# EAGLE design busstop (EAGLE 6.6.0)
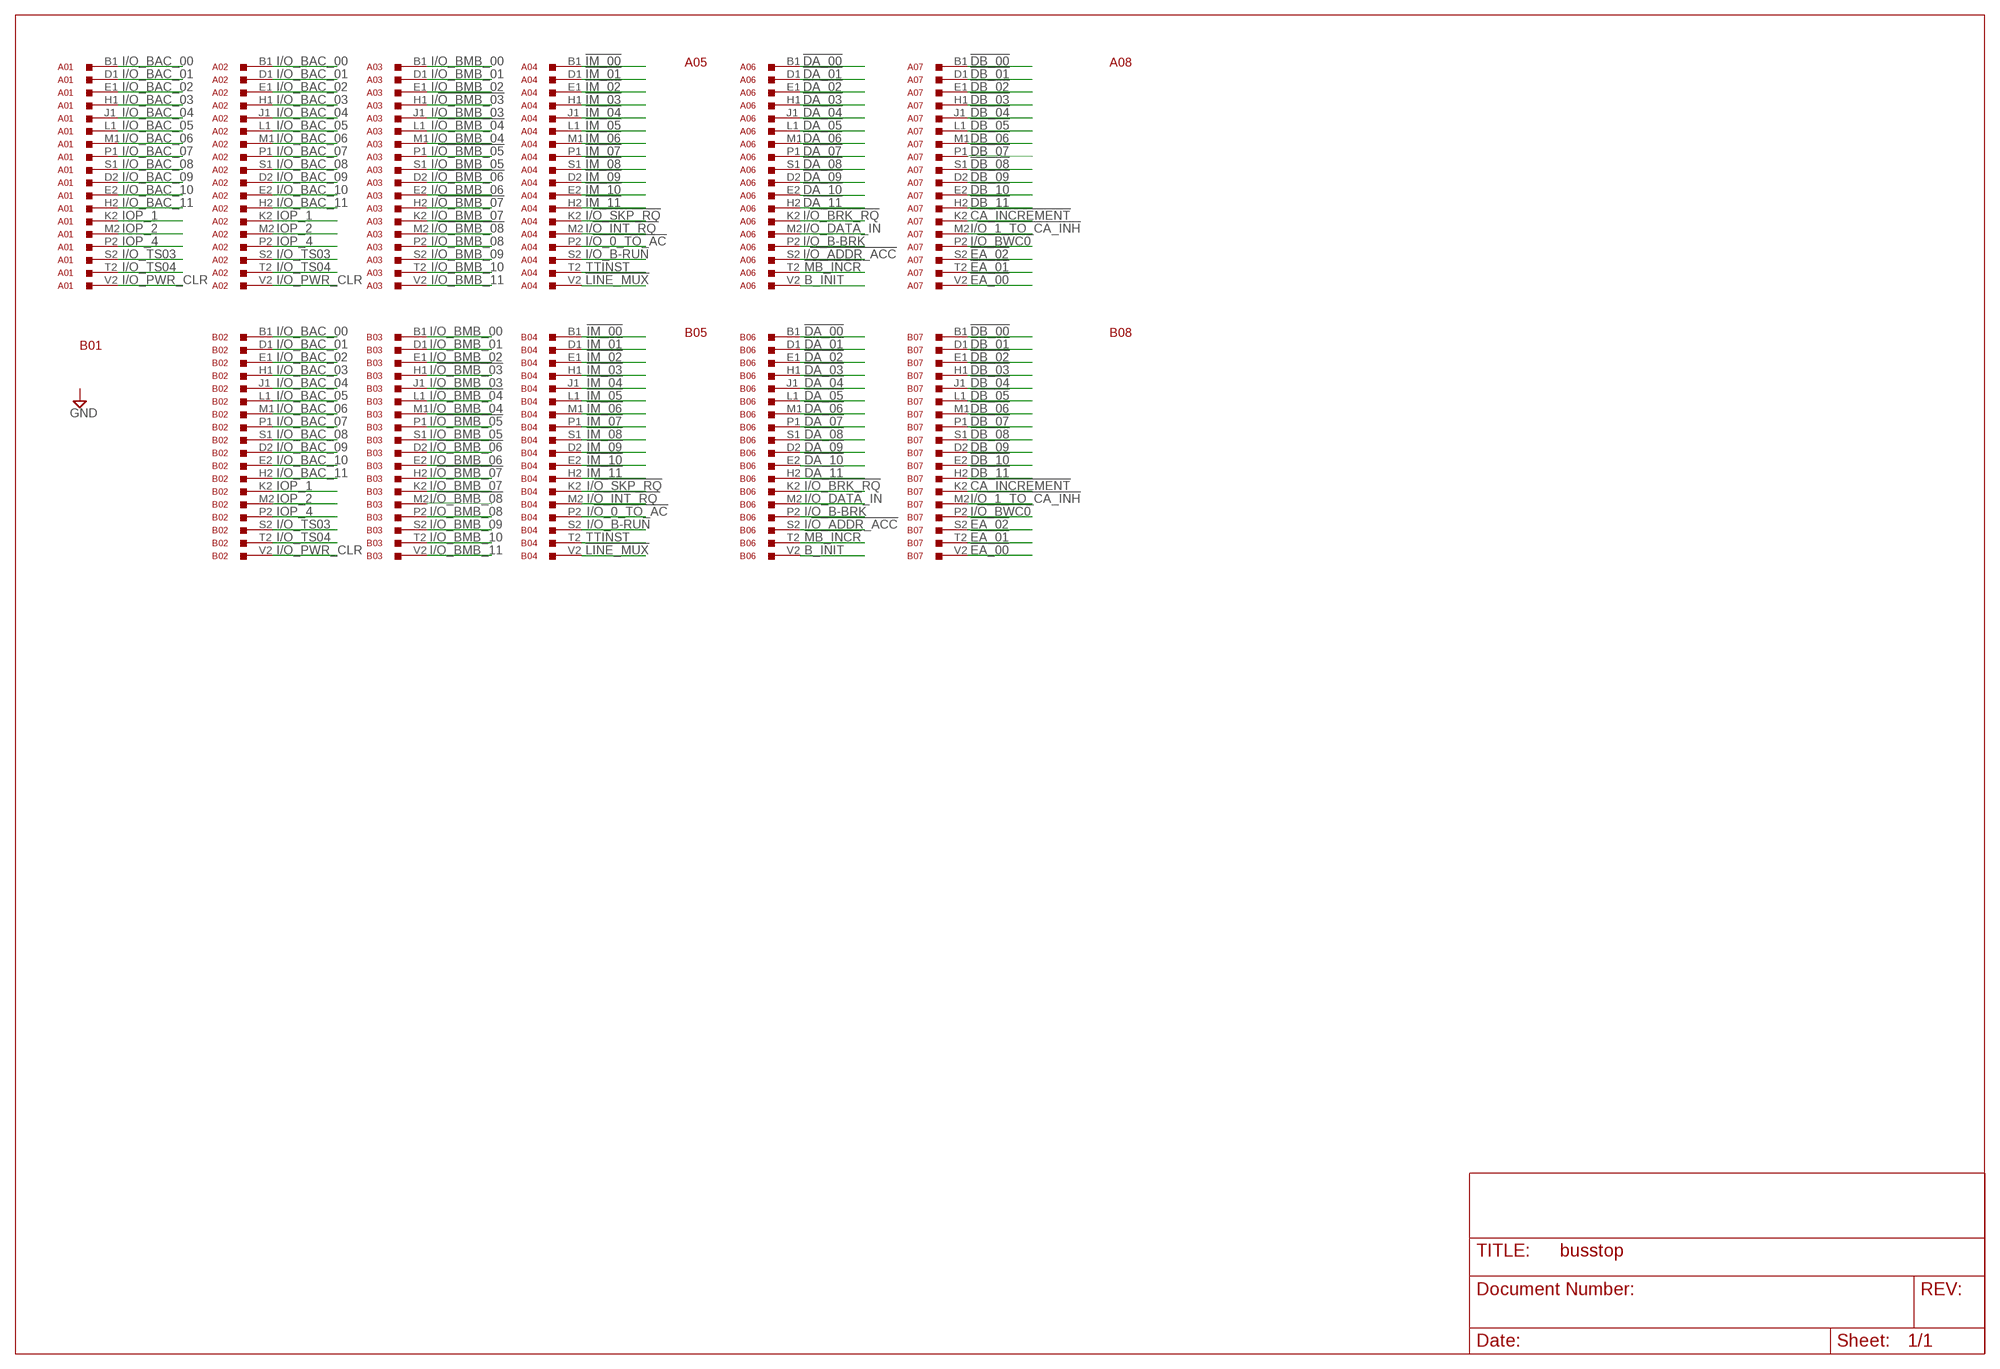
[diagram p0: schematic, sheet 1]

## Parts
A01  G717  M903  [H807]
A02  M903  [H807]
A03  M903  [H807]
A04  M903  [H807]
A05  H807  [H807]
A06  M903  [H807]
A07  M903  [H807]
A08  H807  [H807]
B01  H807  [H807]
B02  M903  [H807]
B03  M903  [H807]
B04  M903  [H807]
B05  H807  [H807]
B06  M903  [H807]
B07  M903  [H807]
B08  H807  [H807]

## Nets
!CA_INCREMENT: A07.K2 B07.K2
!DA_00: A06.B1 B06.B1
!DA_01: A06.D1 B06.D1
!DA_02: A06.E1 B06.E1
!DA_03: A06.H1 B06.H1
!DA_04: A06.J1 B06.J1
!DA_05: A06.L1 B06.L1
!DA_06: A06.M1 B06.M1
!DA_07: A06.P1 B06.P1
!DA_08: A06.S1 B06.S1
!DA_09: A06.D2 B06.D2
!DA_10: A06.E2 B06.E2
!DA_11: A06.H2 B06.H2
!DB_00: A07.B1 B07.B1
!DB_01: A07.D1 B07.D1
!DB_02: A07.E1 B07.E1
!DB_03: A07.H1 B07.H1
!DB_04: A07.J1 B07.J1
!DB_05: A07.L1 B07.L1
!DB_06: A07.M1 B07.M1
!DB_07: A07.P1 B07.P1
!DB_08: A07.S1 B07.S1
!DB_09: A07.D2 B07.D2
!DB_10: A07.E2 B07.E2
!DB_11: A07.H2 B07.H2
!EA_00: A07.V2 B07.V2
!EA_01: A07.T2 B07.T2
!EA_02: A07.S2 B07.S2
!IM_00: A04.B1 B04.B1
!IM_01: A04.D1 B04.D1
!IM_02: A04.E1 B04.E1
!IM_03: A04.H1 B04.H1
!IM_04: A04.J1 B04.J1
!IM_05: A04.L1 B04.L1
!IM_06: A04.M1 B04.M1
!IM_07: A04.P1 B04.P1
!IM_08: A04.S1 B04.S1
!IM_09: A04.D2 B04.D2
!IM_10: A04.E2 B04.E2
!IM_11: A04.H2 B04.H2
!LINE_MUX: A04.V2 B04.V2
!MB_INCR: A06.T2 B06.T2
B_INIT: A06.V2 B06.V2
I/!O_0_TO_AC: A04.P2 B04.P2
I/!O_1_TO_CA_INH: A07.M2 B07.M2
I/!O_ADDR_ACC: A06.S2 B06.S2
I/!O_BMB_03: A03.H1 B03.H1
I/!O_BMB_04: A03.L1 B03.L1
I/!O_BMB_05: A03.P1 B03.P1
I/!O_BMB_06: A03.D2 B03.D2
I/!O_BMB_07: A03.H2 B03.H2
I/!O_BMB_08: A03.M2 B03.M2
I/!O_BRK_RQ: A06.K2 B06.K2
I/!O_BWC0: A07.P2 B07.P2
I/!O_INT_RQ: A04.M2 B04.M2
I/!O_SKP_RQ: A04.K2 B04.K2
I/O_B-BRK: A06.P2 B06.P2
I/O_B-RUN: A04.S2 B04.S2
I/O_BAC_00: A01.B1 A02.B1 B02.B1
I/O_BAC_01: A01.D1 A02.D1 B02.D1
I/O_BAC_02: A01.E1 A02.E1 B02.E1
I/O_BAC_03: A01.H1 A02.H1 B02.H1
I/O_BAC_04: A01.J1 A02.J1 B02.J1
I/O_BAC_05: A01.L1 A02.L1 B02.L1
I/O_BAC_06: A01.M1 A02.M1 B02.M1
I/O_BAC_07: A01.P1 A02.P1 B02.P1
I/O_BAC_08: A01.S1 A02.S1 B02.S1
I/O_BAC_09: A01.D2 A02.D2 B02.D2
I/O_BAC_10: A01.E2 A02.E2 B02.E2
I/O_BAC_11: A01.H2 A02.H2 B02.H2
I/O_BMB_00: A03.B1 B03.B1
I/O_BMB_01: A03.D1 B03.D1
I/O_BMB_02: A03.E1 B03.E1
I/O_BMB_03: A03.J1 B03.J1
I/O_BMB_04: A03.M1 B03.M1
I/O_BMB_05: A03.S1 B03.S1
I/O_BMB_06: A03.E2 B03.E2
I/O_BMB_07: A03.K2 B03.K2
I/O_BMB_08: A03.P2 B03.P2
I/O_BMB_09: A03.S2 B03.S2
I/O_BMB_10: A03.T2 B03.T2
I/O_BMB_11: A03.V2 B03.V2
I/O_DATA_IN: A06.M2 B06.M2
I/O_PWR_CLR: A01.V2 A02.V2 B02.V2
I/O_TS03: A01.S2 A02.S2 B02.S2
I/O_TS04: A01.T2 A02.T2 B02.T2
IOP_1: A01.K2 A02.K2 B02.K2
IOP_2: A01.M2 A02.M2 B02.M2
IOP_4: A01.P2 A02.P2 B02.P2
TTINST: A04.T2 B04.T2

## Power pins joined to a net without a drawn wire
GND: A01.A1 A01.C1 A01.C2 A01.F1 A01.F2 A01.J2 A01.K1 A01.L2 A01.N1 A01.N2 A01.R1 A01.R2 A01.T1 A01.U2 A02.A1 A02.C1 A02.C2 A02.F1 A02.F2 A02.J2 A02.K1 A02.L2 A02.N1 A02.N2 A02.R1 A02.R2 A02.T1 A02.U2 A03.A1 A03.C1 A03.C2 A03.F1 A03.F2 A03.J2 A03.K1 A03.L2 A03.N1 A03.N2 A03.R1 A03.R2 A03.T1 A03.U2 A04.A1 A04.C1 A04.C2 A04.F1 A04.F2 A04.J2 A04.K1 A04.L2 A04.N1 A04.N2 A04.R1 A04.R2 A04.T1 A04.U2 A06.A1 A06.C1 A06.C2 A06.F1 A06.F2 A06.J2 A06.K1 A06.L2 A06.N1 A06.N2 A06.R1 A06.R2 A06.T1 A06.U2 A07.A1 A07.C1 A07.C2 A07.F1 A07.F2 A07.J2 A07.K1 A07.L2 A07.N1 A07.N2 A07.R1 A07.R2 A07.T1 A07.U2 B02.A1 B02.C1 B02.C2 B02.F1 B02.F2 B02.J2 B02.K1 B02.L2 B02.N1 B02.N2 B02.R1 B02.R2 B02.T1 B02.U2 B03.A1 B03.C1 B03.C2 B03.F1 B03.F2 B03.J2 B03.K1 B03.L2 B03.N1 B03.N2 B03.R1 B03.R2 B03.T1 B03.U2 B04.A1 B04.C1 B04.C2 B04.F1 B04.F2 B04.J2 B04.K1 B04.L2 B04.N1 B04.N2 B04.R1 B04.R2 B04.T1 B04.U2 B06.A1 B06.C1 B06.C2 B06.F1 B06.F2 B06.J2 B06.K1 B06.L2 B06.N1 B06.N2 B06.R1 B06.R2 B06.T1 B06.U2 B07.A1 B07.C1 B07.C2 B07.F1 B07.F2 B07.J2 B07.K1 B07.L2 B07.N1 B07.N2 B07.R1 B07.R2 B07.T1 B07.U2

## Library data of the parts
A01-A04 A06 A07 B02-B04 B06 B07 = dec-m:M903: Two-sided Posibus cable/connector.
A05 A08 B01 B05 B08 = dec-m:H807: Empty card slot

## Net classes
0 default: width 0.381 mm
1 supply: width 0.762 mm, drill 0.381 mm, clearance 0.381 mm

## Board
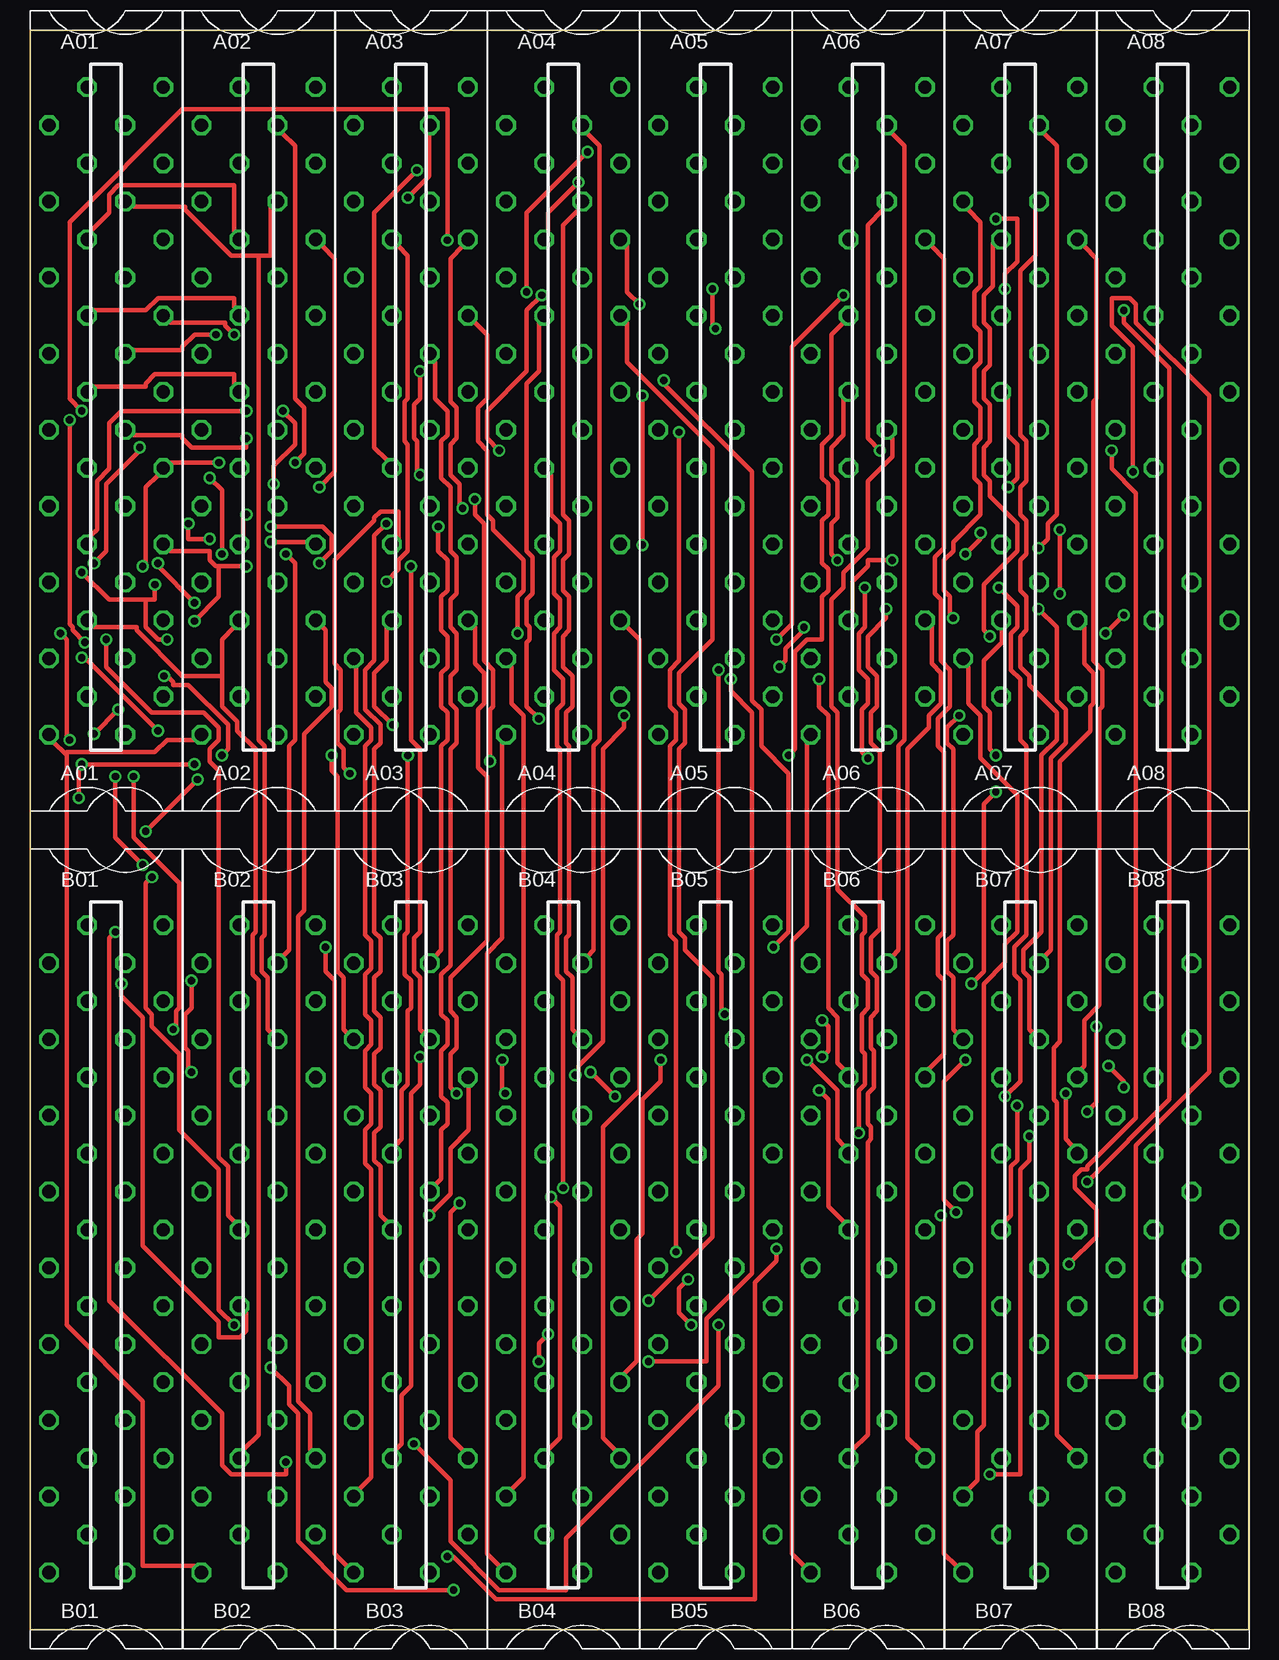
[diagram p1: board, top side]
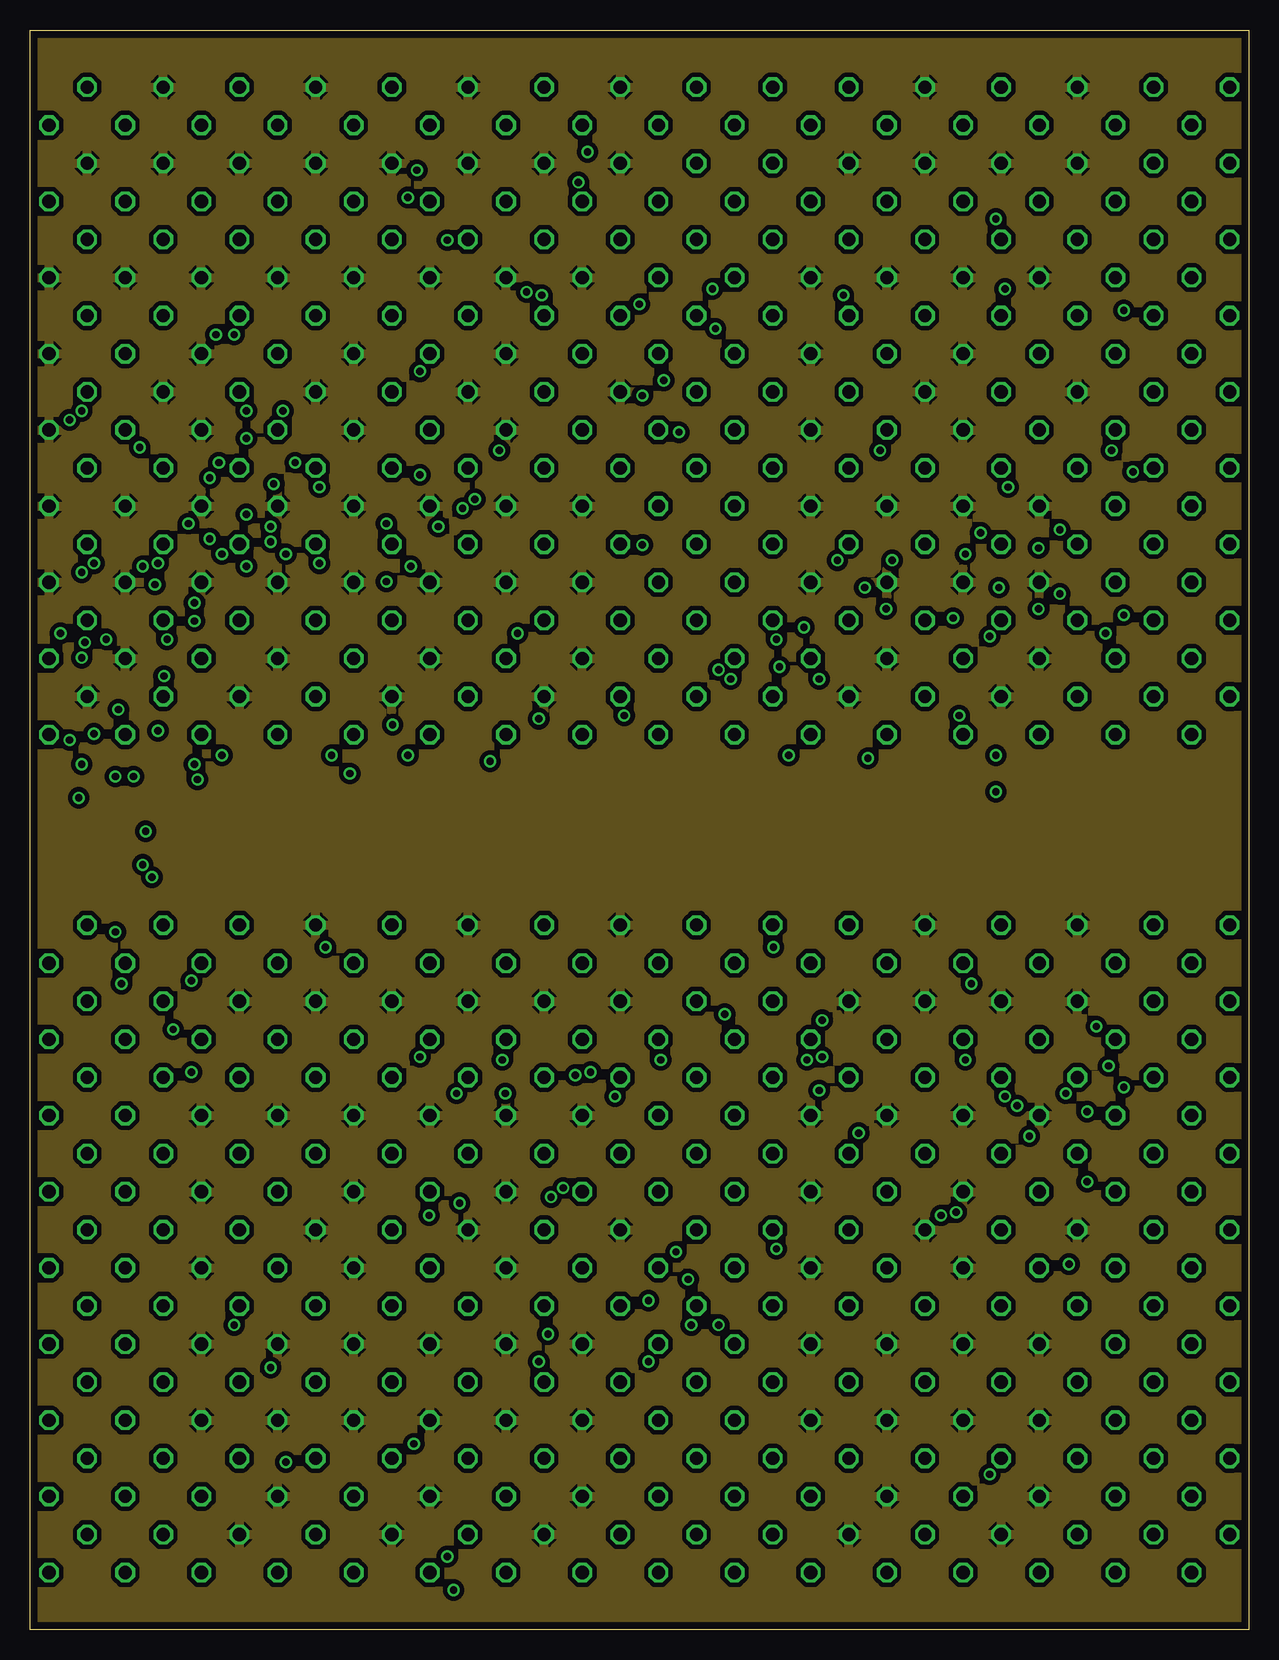
[diagram p2: board, inner layer GND$]
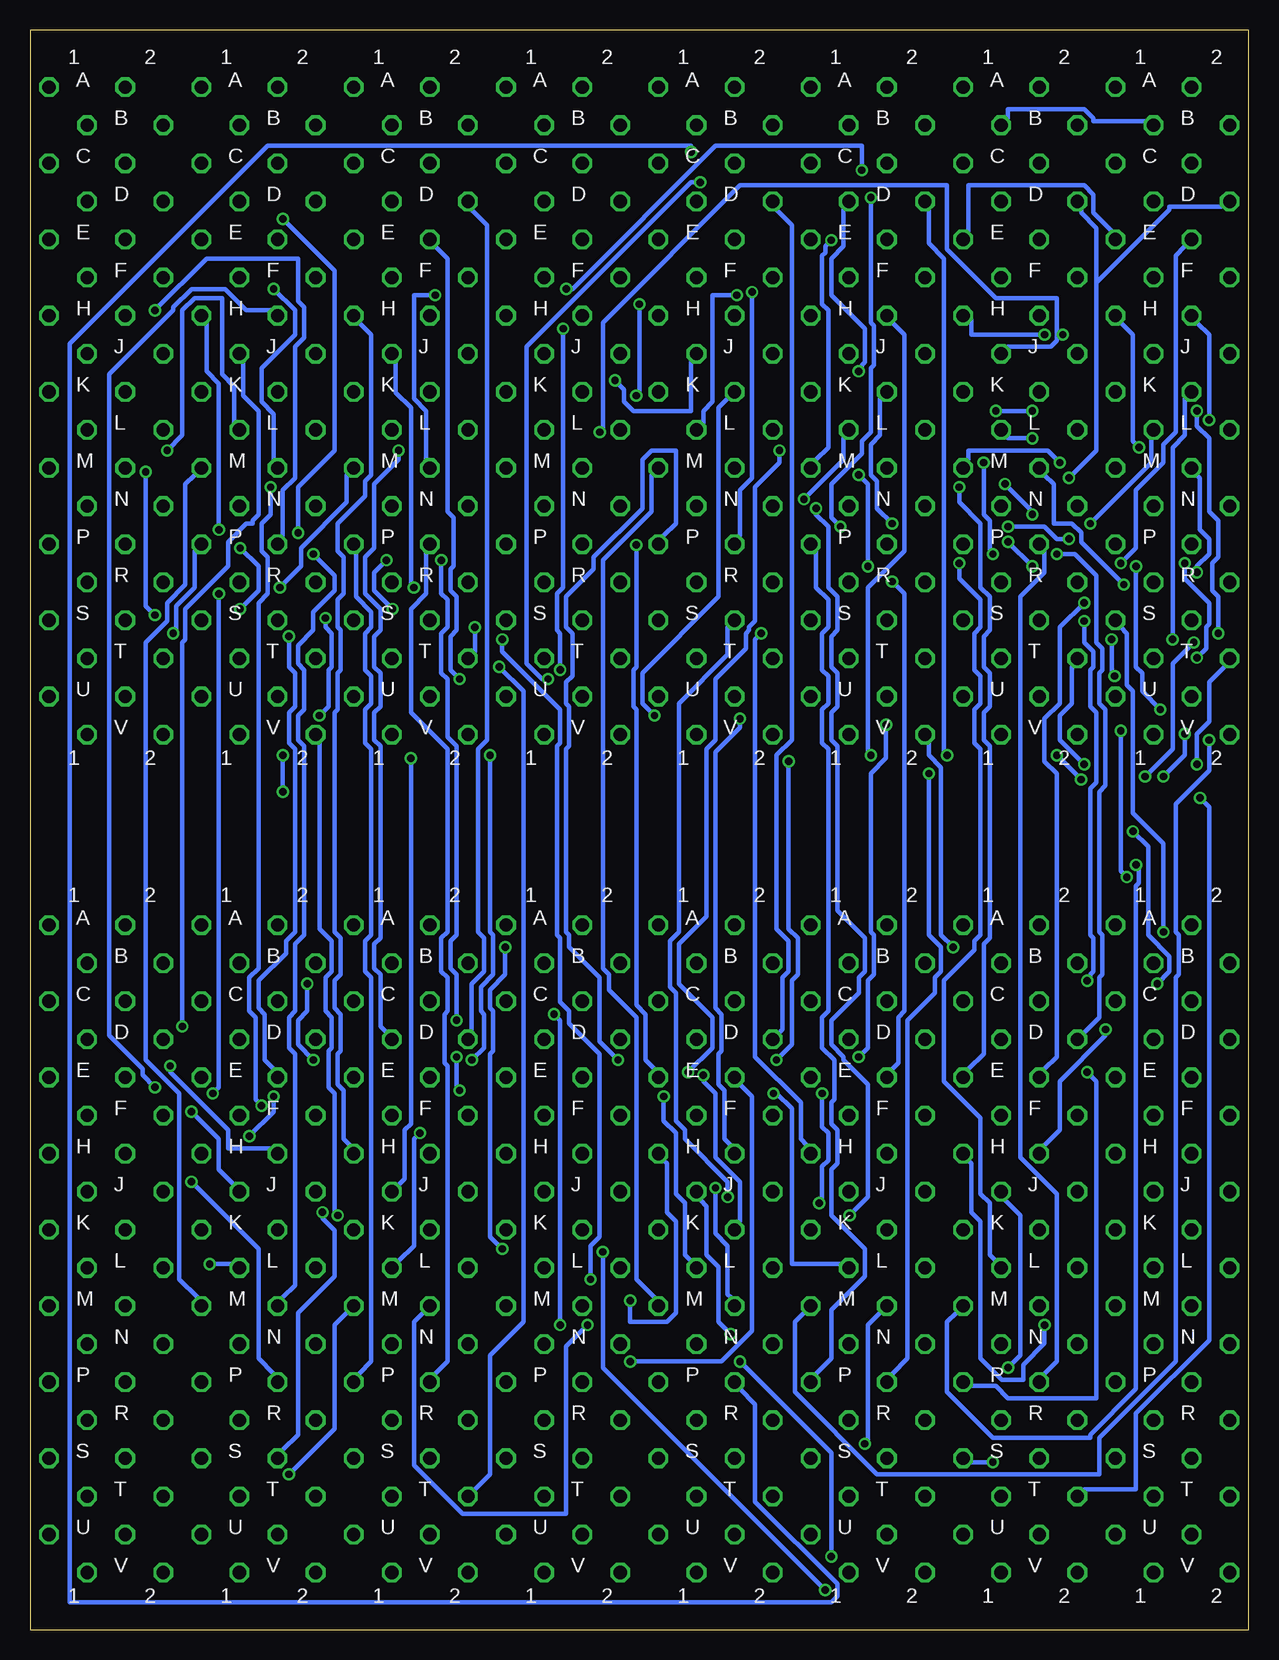
[diagram p3: board, bottom side, seen from below]

Size 101.6 x 133.35 mm. Coordinates in mm from the lower left corner, seen from the top.
Outline: 0,0 0,133.35 101.6,133.35 101.6,0 0,0
Copper layers (1*2*16): Top 0.035mm / dielectric 1.5mm / GND$ 0.035mm / dielectric 0.15mm / Bottom 0.035mm
Design rules "default *": minimum track width 10mil, minimum drill 24mil, track to track 8mil, track to pad 8mil, pad to pad 8mil, via to via 8mil, smd to smd 8mil, copper to edge 25mil, drill to drill 8mil, minimum pad ring 10mil, minimum via ring 8mil, stop-mask expansion 4mil, vias tented up to drill 0mil, thermal gap 10mil

### Footprints (pad centres in the part's own frame; a part is rotated, then mirrored left to right if it is on the bottom)
H807 = drill 1.092 octagon: A1 4.763,28.575; A2 -1.587,28.575; B1 1.587,25.4; B2 -4.763,25.4; C1 4.763,22.225; C2 -1.587,22.225; D1 1.587,19.05; D2 -4.763,19.05; E1 4.763,15.875; E2 -1.587,15.875; F1 1.587,12.7; F2 -4.763,12.7; H1 4.763,9.525; H2 -1.587,9.525; J1 1.587,6.35; J2 -4.763,6.35; K1 4.763,3.175; K2 -1.587,3.175; L1 1.587,0; L2 -4.763,0; M1 4.763,-3.175; M2 -1.587,-3.175; N1 1.587,-6.35; N2 -4.763,-6.35; P1 4.763,-9.525; P2 -1.587,-9.525; R1 1.587,-12.7; R2 -4.763,-12.7; S1 4.763,-15.875; S2 -1.587,-15.875; T1 1.587,-19.05; T2 -4.763,-19.05; U1 4.763,-22.225; U2 -1.587,-22.225; V1 1.587,-25.4; V2 -4.763,-25.4

### Placement (x,y rotation side)
A01  6.35,100.01 0 top
A02  19.05,100.01 0 top
A03  31.75,100.01 0 top
A04  44.45,100.01 0 top
A05  57.15,100.01 0 top
A06  69.85,100.01 0 top
A07  82.55,100.01 0 top
A08  95.25,100.01 0 top
B01  6.35,30.16 0 top
B02  19.05,30.16 0 top
B03  31.75,30.16 0 top
B04  44.45,30.16 0 top
B05  57.15,30.16 0 top
B06  69.85,30.16 0 top
B07  82.55,30.16 0 top
B08  95.25,30.16 0 top
U$5  [CBLOCK]  0,0 0 top
U$6  [CBLOCK]  50.8,0 0 top

### Tracks (layer width: path | path; a pad name or v marks a point on that pad's centre or on a via)
!CA_INCREMENT  (via drill 0.61)
  Top 0.381: v82.3,43.69 82.3,39.12 81.79,38.61 81.79,34.54 81.28,34.04 B07.K2 | v81.53,95.25 82.3,96.01 82.3,98.81 81.53,99.57 81.53,102.62 A07.K2
  Bottom 0.381: v82.3,43.69 82.8,44.2 82.8,51.05 83.31,51.56 83.31,54.36 82.55,55.12 82.55,85.6 81.79,86.36 81.79,89.41 82.3,89.92 82.3,92.2 81.53,92.96 v81.53,95.25
!DA_00
  Top 0.381: B06.B1 71.88,56.13 72.39,56.64 72.39,73.66 72.9,74.17 72.9,123.7 71.88,124.71 A06.B1
!DA_01  (via drill 0.61)
  Top 0.381: v70.87,98.3 69.85,99.31 69.85,117.09 71.12,118.36 A06.D1
  Bottom 0.381: v70.87,98.3 70.87,97.54 72.9,95.5 72.9,90.17 73.66,89.41 73.66,86.36 72.39,85.09 72.39,83.31 72.9,82.8 72.9,80.26 72.39,79.76 72.39,76.96 72.9,76.45 72.9,74.17 72.39,73.66 72.39,57.66 72.9,57.15 72.9,55.12 72.39,54.61 72.39,50.29 71.88,49.78 B06.D1
!DA_02
  Top 0.381: B06.E1 74.93,46.74 76.2,48.01 76.2,54.1 75.69,54.61 75.69,57.66 76.2,58.17 76.2,73.15 75.69,73.66 75.69,75.95 76.71,76.96 76.71,80.01 75.95,80.77 75.95,85.85 75.44,86.36 75.44,89.41 76.2,90.17 76.2,114.3 75.18,115.32 A06.E1
!DA_03
  Bottom 0.381: B06.H1 74.93,40.39 75.44,40.89 75.44,44.96 75.95,45.47 75.95,48.01 75.69,48.26 75.69,51.31 76.2,51.82 76.2,54.1 75.69,54.61 75.69,57.66 76.2,58.17 76.2,76.45 75.95,76.71 75.95,79.76 75.69,80.01 75.69,83.31 75.95,83.57 75.95,85.85 75.44,86.36 75.44,89.41 75.95,89.92 75.95,92.2 73.66,94.49 73.66,95.76 73.15,96.27 73.15,107.95 74.17,108.97 A06.H1
!DA_04  (via drill 0.61)
  Top 0.381: v69.85,72.64 69.34,73.15 69.34,76.71 69.85,77.22 69.85,79.25 69.09,80.01 69.09,83.06 69.6,83.57 v69.6,86.87
  Bottom 0.381: v69.85,72.64 69.85,42.16 70.36,41.66 70.36,37.59 70.87,37.08 B06.J1 | v69.6,86.87 69.85,87.12 69.85,101.85 71.12,103.12 71.12,105.66 A06.J1
!DA_05  (via drill 0.61)
  Top 0.381: v69.09,41.4 69.09,44.96 69.6,45.47 69.6,48.01 69.34,48.26 69.34,51.31 69.85,51.82 69.85,54.1 69.34,54.61 69.34,57.91 69.6,58.17 69.6,59.44 67.31,61.72 67.31,76.45 66.8,76.96 66.8,85.85 67.82,86.87 67.82,88.14 69.85,90.17 69.85,95.76 71.88,97.79 71.88,99.31 A06.L1
  Bottom 0.381: v69.09,41.4 69.6,40.89 69.6,32 70.87,30.73 B06.L1
!DA_06  (via drill 0.61)
  Top 0.381: v80.01,12.95 82.55,12.95 82.55,38.35 83.31,39.12 v83.31,41.15 | v81.28,44.45 82.55,45.72 82.55,54.1 82.04,54.61 82.04,56.9 83.06,57.91 83.06,73.66 82.55,74.17 82.55,79.25 81.79,80.01 81.79,83.06 82.3,83.57 82.3,85.34 v80.77,86.87
  Bottom 0.381: v80.01,12.95 76.2,16.76 76.2,25.4 75.18,26.42 B06.M1 | v83.31,41.15 81.28,43.18 v81.28,44.45 | v80.77,86.87 78.99,88.65 78.99,90.17 75.18,93.98 75.18,96.27 A06.M1
!DA_07
  Bottom 0.381: B06.P1 74.17,21.34 73.15,22.35 73.15,54.36 73.66,54.86 73.66,57.4 73.15,57.91 73.15,73.41 73.66,73.91 73.66,76.71 73.15,77.22 73.15,79.5 73.66,80.01 73.66,83.06 73.15,83.57 73.15,84.84 74.42,86.11 74.42,89.92 A06.P1
!DA_08
  Top 0.381: B06.S1 74.17,14.99 73.15,16 73.15,73.41 74.93,75.18 74.93,76.2 75.95,77.22 75.95,79.76 75.18,80.52 75.18,83.57 A06.S1
!DA_09
  Bottom 0.381: B06.D2 64.77,49.78 64.77,53.85 63.75,54.86 63.75,57.66 64.26,58.17 64.26,73.41 63.5,74.17 63.5,117.09 64.77,118.36 A06.D2
!DA_10  (via drill 0.61)
  Top 0.381: v65.79,79.25 65.79,76.96 66.55,76.2 66.55,51.82 67.31,51.05 67.31,47.24 67.82,46.74 B06.E2
  Bottom 0.381: v65.79,79.25 66.55,80.01 66.55,82.8 66.04,83.31 66.04,86.11 66.55,86.61 66.55,88.39 66.29,88.65 66.29,92.71 66.8,93.22 66.8,114.3 67.82,115.32 A06.E2
!DA_11  (via drill 0.61)
  Top 0.381: v64.77,47.5 67.31,44.96 67.31,40.89 67.82,40.39 B06.H2 | v63.25,72.9 63.75,73.41 63.75,81.53 64.77,82.55 66.04,82.55 66.04,86.11 66.55,86.61 66.55,88.39 66.04,88.9 66.04,92.46 66.55,92.96 66.55,95.5 66.04,96.01 66.04,98.81 66.8,99.57 66.8,107.95 67.82,108.97 A06.H2
  Bottom 0.381: v64.77,47.5 63.75,48.51 63.75,51.31 64.01,51.56 64.01,53.59 62.99,54.61 62.99,57.91 63.25,58.17 v63.25,72.9
!DB_00  (via drill 0.61)
  Top 0.381: v84.07,85.09 85.6,83.57 85.6,77.47 86.36,76.71 86.36,73.91 85.09,72.64 85.09,56.64 84.58,56.13 B07.B1 | v84.07,90.17 84.84,90.93 84.84,92.2 85.6,92.96 85.6,123.7 84.58,124.71 A07.B1
  Bottom 0.381: v84.07,85.09 82.55,86.61 82.55,88.65 v84.07,90.17
!DB_01
  Top 0.381: B07.D1 83.57,49.78 83.31,50.04 83.31,54.36 82.8,54.86 82.8,56.64 84.33,58.17 84.33,72.9 85.6,74.17 85.6,76.45 83.31,78.74 83.31,79.5 82.55,80.26 82.55,82.8 83.06,83.31 83.06,86.11 82.55,86.61 82.55,89.15 83.06,89.66 83.06,92.46 82.55,92.96 82.55,95.25 83.06,95.76 83.06,99.06 82.55,99.57 82.55,113.28 83.82,114.55 83.82,118.36 A07.D1
!DB_02
  Top 0.381: B07.E1 87.63,46.74 87.88,46.99 87.88,50.8 89.15,52.07 89.15,76.71 89.41,76.96 89.41,80.01 88.65,80.77 88.65,102.36 88.9,102.62 88.9,114.3 87.88,115.32 A07.E1
!DB_03  (via drill 0.61)
  Top 0.381: v86.36,44.7 86.36,40.89 86.87,40.39 B07.H1 | v85.85,86.36 v85.85,91.69
  Bottom 0.381: v86.36,44.7 85.85,45.21 v85.85,86.36 | v85.85,91.69 85.85,103.89 86.87,104.9 86.87,108.97 A07.H1
!DB_04  (via drill 0.61)
  Top 0.381: v88.14,43.18 88.9,43.94 v88.9,50.29
  Bottom 0.381: v88.14,43.18 85.85,40.89 85.85,38.35 84.58,37.08 B07.J1 | v88.9,50.29 88.9,82.3 88.65,82.55 88.65,85.09 85.09,88.65 85.09,90.68 83.57,92.2 83.06,92.2 83.06,92.46 82.55,92.96 82.55,101.6 83.82,102.87 83.82,105.66 A07.J1
!DB_05  (via drill 0.61)
  Top 0.381: v86.61,30.48 88.9,32.77 88.9,35.05 87.12,36.83 87.12,37.85 87.63,38.35 88.14,38.35 88.14,38.61 92.2,42.67 92.2,94.74 90.17,96.77 v90.17,98.3
  Bottom 0.381: v86.61,30.48 84.84,30.48 B07.L1 | v90.17,98.3 88.9,99.57 88.9,109.98 87.88,111 85.6,111 85.6,104.65 84.58,103.63 84.58,100.58 A07.L1
!DB_06
  Bottom 0.381: B07.M1 87.63,27.69 89.15,29.21 89.15,44.7 91.95,47.5 91.95,82.3 90.17,84.07 90.17,85.6 88.65,87.12 88.65,95.5 87.88,96.27 A07.M1
!DB_07  (via drill 0.61)
  Top 0.381: v91.95,96.52 91.95,106.93 90.17,108.71 90.17,111 91.69,111 92.2,110.49 92.2,108.97 98.3,102.87 98.3,46.48 92.2,40.39 92.2,21.08 87.88,21.08 B07.P1 | v91.19,84.58 v89.66,83.06
  Bottom 0.381: v91.95,96.52 91.95,85.34 v91.19,84.58 | v89.66,83.06 89.41,83.31 89.41,85.34 87.88,86.87 87.88,89.92 A07.P1
!DB_08
  Top 0.381: B07.S1 86.87,14.99 85.6,16.26 85.6,43.94 85.34,44.2 85.34,48.51 85.85,49.02 85.85,72.39 88.39,74.93 88.39,76.96 88.65,77.22 88.65,79.76 87.88,80.52 87.88,83.57 A07.S1
!DB_09  (via drill 0.61)
  Top 0.381: v77.47,76.2 76.45,75.18 76.45,73.91 76.96,73.41 76.96,57.91 76.45,57.4 76.45,54.86 76.96,54.36 76.96,50.04 77.22,49.78 B07.D2 | v76.96,84.33 76.71,84.58 76.71,86.11 76.2,86.61 76.2,89.15 76.96,89.92 76.96,90.68 79.25,92.96 79.25,95.5 78.74,96.01 78.74,98.81 79.25,99.31 79.25,101.85 78.74,102.36 78.74,105.16 79.25,105.66 79.25,108.2 78.74,108.71 78.74,111.51 79.25,112.01 79.25,117.35 78.23,118.36 A07.D2
  Bottom 0.381: v77.47,76.2 76.71,76.96 76.71,80.01 76.45,80.26 76.45,83.06 76.96,83.57 v76.96,84.33
!DB_10  (via drill 0.61)
  Top 0.381: v80.01,82.8 79.5,83.31 79.5,87.12 82.3,89.92 82.3,92.2 80.01,94.49 80.01,95.76 79.5,96.27 79.5,98.55 80.01,99.06 80.01,102.11 79.5,102.62 79.5,104.9 80.01,105.41 80.01,108.46 79.5,108.97 79.5,111.25 80.26,112.01 80.26,115.57 A07.E2
  Bottom 0.381: v80.01,82.8 80.01,80.26 79.5,79.76 79.5,76.96 80.01,76.45 80.01,73.91 79.5,73.41 79.5,58.17 80.26,57.4 80.26,56.39 82.55,54.1 82.55,51.82 82.04,51.31 82.04,47.5 81.28,46.74 B07.E2
!DB_11  (via drill 0.61)
  Top 0.381: v89.92,46.99 91.19,45.72 v91.19,45.21
  Bottom 0.381: v89.92,46.99 89.92,46.48 85.09,41.66 85.09,40.13 81.53,40.13 B07.H2 | v91.19,45.21 92.2,46.23 92.2,46.74 95,49.53 95,104.65 89.66,109.98 89.66,110.24 88.14,111.76 85.34,111.76 83.57,109.98 81.53,109.98 A07.H2
!EA_00  (via drill 0.61)
  Top 0.381: v75.95,34.54 76.2,34.29 76.2,6.35 77.22,5.33 B07.V2
  Bottom 0.381: v75.95,34.54 76.2,34.8 76.2,44.7 76.71,45.21 76.71,48.26 76.45,48.51 76.45,51.05 76.96,51.56 76.96,54.36 76.45,54.86 76.45,57.4 77.47,58.42 77.47,73.91 A07.V2
!EA_01
  Top 0.381: B07.T2 78.23,11.68 78.99,12.45 78.99,16.51 79.5,17.02 79.5,53.85 81.28,55.63 81.28,57.15 82.3,58.17 82.3,69.6 79.25,72.64 79.25,76.2 78.23,77.22 78.23,80.26 A07.T2
!EA_02  (via drill 0.61)
  Top 0.381: v77.22,34.8 76.2,35.81 76.2,45.72 v77.98,47.5 | v78.49,53.85 79.5,54.86 79.5,68.83 v80.52,69.85 | v80.52,72.9 80.01,73.41 80.01,76.45 79.5,76.96 79.5,80.77 81.03,82.3 81.03,83.57 A07.S2
  Bottom 0.381: v77.22,34.8 77.22,34.29 76.2,33.27 76.2,29.46 79.25,26.42 79.25,16.26 80.52,14.99 B07.S2 | v77.98,47.5 79.25,48.77 79.25,50.8 78.49,51.56 v78.49,53.85 | v80.52,69.85 v80.52,72.9
!IM_00
  Top 0.381: B04.B1 46.48,56.13 46.99,56.64 46.99,73.66 47.5,74.17 47.5,123.7 46.48,124.71 A04.B1
!IM_01
  Top 0.381: B04.D1 45.47,49.78 45.21,50.04 45.21,54.36 44.7,54.86 44.7,57.66 44.96,57.91 44.96,73.66 44.7,73.91 44.7,76.45 45.21,76.96 45.21,79.5 44.45,80.26 44.45,82.8 44.96,83.31 44.96,86.11 44.45,86.61 44.45,89.15 44.96,89.66 44.96,92.46 44.45,92.96 44.45,117.09 45.72,118.36 A04.D1
!IM_02  (via drill 0.61)
  Top 0.381: v51.05,90.42 v51.05,102.87 | v50.8,110.49 49.78,111.51 49.78,115.32 A04.E1
  Bottom 0.381: v51.05,90.42 51.05,80.26 51.31,80.01 51.31,76.96 51.05,76.71 51.05,52.07 50.29,51.31 50.29,47.5 49.53,46.74 B04.E1 | v51.05,102.87 50.8,103.12 v50.8,110.49
!IM_03  (via drill 0.61)
  Top 0.381: v51.56,27.43 56.9,32.77 56.9,54.36 54.61,56.64 54.61,57.66 54.1,58.17 54.1,73.41 54.61,73.91 54.61,76.71 54.1,77.22 54.1,79.76 56.9,82.55 56.9,98.55 49.78,105.66 49.78,108.97 A04.H1
  Bottom 0.381: v51.56,27.43 51.56,25.65 48.51,25.65 47.75,26.42 47.75,34.04 48.51,34.8 48.51,38.86 48.77,39.12 B04.H1
!IM_04  (via drill 0.61)
  Top 0.381: v43.18,24.64 42.42,23.88 v42.42,22.35 | v34.8,6.1 35.31,6.1 38.86,2.54 60.45,2.54 60.45,28.96 62.23,30.73 v62.23,31.75 | v61.98,56.9 63.25,58.17 63.25,71.37 60.96,73.66 60.96,76.71 60.2,77.47 60.2,96.52 52.83,103.89 v52.83,104.14
  Bottom 0.381: v43.18,24.64 44.2,25.65 44.2,30.23 45.21,31.24 45.21,35.31 45.72,35.81 B04.J1 | v42.42,22.35 34.8,14.73 v34.8,6.1 | v62.23,31.75 63.25,32.77 63.25,48.01 62.99,48.26 62.99,51.56 63.25,51.82 63.25,53.34 61.98,54.61 v61.98,56.9 | v52.83,104.14 52.07,103.38 52.07,102.36 51.31,101.6 46.48,101.6 46.48,105.66 A04.J1
!IM_05  (via drill 0.61)
  Top 0.381: v48.77,44.45 v46.74,46.48 | v39.12,98.3 38.1,99.31 38.1,101.6 41.4,104.9 41.4,109.98 v42.67,111.25
  Bottom 0.381: v48.77,44.45 48.77,42.42 47.75,41.4 47.75,36.32 46.99,35.56 46.99,31.24 46.48,30.73 B04.L1 | v46.74,46.48 44.7,48.51 44.7,51.05 47.5,53.85 47.5,57.15 45.21,59.44 45.21,73.41 44.45,74.17 44.45,79.25 41.91,81.79 41.91,83.06 41.66,83.31 41.66,83.57 41.15,84.07 41.15,95.25 39.12,97.28 v39.12,98.3 | v42.67,111.25 44.7,111.25 44.7,102.36 45.47,101.6 45.47,100.58 A04.L1
!IM_06
  Bottom 0.381: B04.M1 49.53,27.69 51.05,29.21 51.05,51.05 53.34,53.34 53.34,54.61 53.85,55.12 53.85,89.15 49.78,93.22 49.78,96.27 A04.M1
!IM_07  (via drill 0.61)
  Top 0.381: v52.58,47.5 52.58,45.72 51.05,44.2 51.05,33.02 50.55,32.51 50.55,22.35 49.53,21.34 B04.P1
  Bottom 0.381: v52.58,47.5 54.1,49.02 54.1,54.36 56.64,56.9 56.64,57.91 56.9,58.17 56.9,73.41 56.64,73.66 56.64,76.96 56.9,77.22 56.9,78.99 56.39,79.5 56.39,83.06 56.9,83.57 56.9,86.11 54.61,88.39 54.61,89.41 50.55,93.47 50.55,97.54 49.78,98.3 47.75,98.3 47.75,92.2 48.77,91.19 A04.P1
!IM_08
  Top 0.381: B04.S1 48.77,14.99 47.75,16 47.75,41.91 50.8,44.96 50.8,82.55 49.78,83.57 A04.S1
!IM_09
  Bottom 0.381: B04.D2 39.12,49.78 38.86,50.04 38.86,54.36 38.35,54.86 38.35,57.4 39.37,58.42 39.37,72.9 38.1,74.17 38.1,117.09 39.37,118.36 A04.D2
!IM_10  (via drill 0.61)
  Top 0.381: v51.56,22.35 56.39,22.35 56.39,25.91 60.2,29.72 60.2,76.45 58.42,78.23 v58.42,79.25 | v45.72,120.65 43.18,118.11 43.18,116.59 A04.E2
  Bottom 0.381: v51.56,22.35 43.94,22.35 41.4,24.89 41.4,44.45 42.42,45.47 B04.E2 | v58.42,79.25 58.93,79.25 60.2,80.52 60.2,106.93 46.48,120.65 v45.72,120.65
!IM_11  (via drill 0.61)
  Top 0.381: v42.42,75.95 41.4,76.96 41.4,82.3 41.66,82.55 41.66,83.57 41.4,83.82 41.4,85.85 41.91,86.36 41.91,89.41 41.4,89.92 41.4,103.89 42.42,104.9 42.42,108.97 A04.H2
  Bottom 0.381: v42.42,75.95 42.42,75.18 44.45,73.15 44.45,51.82 43.94,51.31 43.94,48.26 44.2,48.01 44.2,45.47 43.69,44.96 43.69,40.89 43.18,40.39 B04.H2
!LINE_MUX
  Top 0.381: B04.V2 39.12,5.33 38.1,6.35 38.1,56.39 39.37,57.66 39.37,73.91 A04.V2
!MB_INCR  (via drill 0.61)
  Top 0.381: v62.48,80.26 62.99,80.77 62.99,81.79 64.52,83.31 v64.52,83.57
  Bottom 0.381: v62.48,80.26 60.45,78.23 60.45,25.65 63.25,22.86 63.25,12.95 64.52,11.68 B06.T2 | v64.52,83.57 64.52,81.53 A06.T2
B_INIT
  Top 0.381: B06.V2 64.52,5.33 63.5,6.35 63.5,57.4 64.77,58.67 64.77,73.91 A06.V2
GND
  pour GND$: 0,0 101.6,0 101.6,133.35 0,133.35
I/!O_0_TO_AC  (via drill 0.61)
  Top 0.381: v46.48,123.19 41.4,118.11 v41.4,111.51
  Bottom 0.381: v46.48,123.19 46.48,123.7 81.79,123.7 98.3,107.19 98.3,2.29 34.8,2.29 34.29,2.79 34.29,3.81 41.15,10.67 41.15,18.8 42.42,20.07 B04.P2 | v41.4,111.51 41.4,96.01 42.42,95 42.42,91.19 A04.P2
I/!O_1_TO_CA_INH  (via drill 0.61)
  Top 0.381: v77.98,89.66 79.25,90.93 v79.25,91.44 | v80.52,117.6 82.3,117.6 82.3,114.05 81.28,113.03 v81.28,111.76
  Bottom 0.381: v77.98,89.66 76.2,87.88 76.2,86.61 77.98,84.84 77.98,83.31 79.25,82.04 79.25,80.52 78.74,80.01 78.74,76.71 79.25,76.2 79.25,74.17 78.74,73.66 78.74,57.91 79.5,57.15 79.5,51.56 80.01,51.05 80.01,48.51 79.5,48.01 79.5,28.7 80.52,27.69 B07.M2 | v79.25,91.44 79.25,95.25 76.2,98.3 76.2,113.28 v80.52,117.6 | v81.28,111.76 79.5,109.98 79.5,107.95 82.3,105.16 82.3,102.36 81.28,101.35 81.28,97.54 A07.M2
I/!O_ADDR_ACC  (via drill 0.61)
  Top 0.381: v71.37,85.09 71.37,84.33 69.85,82.8 69.85,80.26 70.61,79.5 70.61,76.96 70.1,76.45 70.1,73.91 70.87,73.15 70.87,58.42 70.1,57.66 70.1,54.86 70.61,54.36 70.61,51.56 70.1,51.05 70.1,48.51 70.36,48.26 70.36,45.21 69.85,44.7 69.85,42.16 70.1,41.91 70.1,40.89 69.85,40.64 69.85,16.26 68.58,14.99 B06.S2 | v71.88,89.15 69.85,89.15 69.85,88.65 68.58,87.38 68.58,84.84 A06.S2
  Bottom 0.381: v71.37,85.09 72.9,86.61 72.9,88.14 v71.88,89.15
I/!O_BMB_03  (via drill 0.61)
  Top 0.381: v40.64,83.06 40.64,86.11 41.15,86.61 41.15,89.15 38.61,91.69 38.61,92.46 38.1,92.96 38.1,98.3 37.34,99.06 37.34,101.85 38.1,102.62 38.1,107.95 37.08,108.97 A03.H1
  Bottom 0.381: v40.64,83.06 41.15,82.55 41.15,47.75 37.34,43.94 37.34,40.89 36.83,40.39 B03.H1
I/!O_BMB_04  (via drill 0.61)
  Top 0.381: v39.62,44.7 39.37,44.96 v39.37,47.5 | v38.35,72.39 38.35,76.71 38.61,76.96 38.61,80.01 37.85,80.77 37.85,92.2 37.08,92.96 v37.08,94.23
  Bottom 0.381: v39.62,44.7 39.37,44.7 38.1,43.43 38.1,30.48 34.04,30.48 B03.L1 | v39.37,47.5 38.1,48.77 38.1,54.1 37.59,54.61 37.59,57.66 38.35,58.42 v38.35,72.39 | v37.08,94.23 33.78,97.54 33.78,99.31 A03.L1
I/!O_BMB_05
  Bottom 0.381: B03.P1 36.07,21.34 34.8,22.61 34.8,26.67 32,29.46 32,31.75 34.8,34.54 34.8,38.35 34.29,38.86 34.29,41.66 34.8,42.16 34.8,43.94 34.54,44.2 34.54,47.5 35.56,48.51 35.56,51.05 35.05,51.56 35.05,73.41 35.56,73.91 35.56,76.71 35.05,77.22 35.05,79.5 35.56,80.01 35.56,83.06 35.05,83.57 35.05,85.85 36.07,86.87 36.07,89.92 A03.P1
I/!O_BMB_06  (via drill 0.61)
  Top 0.381: v25.15,72.9 25.15,71.63 25.65,71.12 25.65,54.86 26.16,54.36 26.16,50.04 26.42,49.78 B03.D2
  Bottom 0.381: v25.15,72.9 25.4,73.15 25.4,114.3 26.67,115.57 26.67,118.36 A03.D2
I/!O_BMB_07  (via drill 0.61)
  Top 0.381: v31.5,72.9 31.5,58.17 31.24,57.91 31.24,54.61 31.75,54.1 31.75,51.82 31.5,51.56 31.5,45.47 30.99,44.96 30.99,40.89 30.48,40.39 B03.H2
  Bottom 0.381: v31.5,72.9 31.75,73.15 31.75,86.87 28.7,89.92 28.7,107.95 29.72,108.97 A03.H2
I/!O_BMB_08  (via drill 0.61)
  Top 0.381: v32,15.49 35.05,12.45 35.05,7.37 39.12,3.3 44.7,3.3 44.7,7.62 57.4,20.32 v57.4,25.4 | v57.91,51.31 57.66,51.56 57.66,54.61 57.4,54.86 v57.4,80.01 | v57.15,108.46 56.9,108.71 v56.9,111.76 | v32.26,121.67 28.7,118.11 28.7,98.55 29.72,97.54 A03.M2
  Bottom 0.381: v32,15.49 31.75,15.75 31.75,25.4 30.73,26.42 B03.M2 | v57.4,25.4 57.4,50.8 v57.91,51.31 | v57.4,80.01 57.4,83.06 57.66,83.31 57.66,86.36 57.15,86.87 v57.15,108.46 | v56.9,111.76 56.39,111.76 44.45,123.7 32.26,123.7 v32.26,121.67
I/!O_BRK_RQ  (via drill 0.61)
  Top 0.381: v65.79,44.96 66.55,44.2 66.55,35.31 67.82,34.04 B06.K2 | v66.04,47.75 66.55,48.26 66.55,50.29 v66.04,50.8 | v67.31,89.15 66.8,89.66 66.8,92.2 67.31,92.71 67.31,95.76 66.8,96.27 66.8,98.55 67.82,99.57 67.82,102.62 A06.K2
  Bottom 0.381: v65.79,44.96 66.04,45.21 v66.04,47.75 | v66.04,50.8 66.04,54.61 66.55,55.12 66.55,57.4 66.04,57.91 66.04,73.66 66.8,74.42 66.8,79.25 67.31,79.76 67.31,83.06 66.8,83.57 66.8,85.85 67.31,86.36 v67.31,89.15
I/!O_BWC0  (via drill 0.61)
  Top 0.381: v88.14,37.34 95,44.2 95,105.16 91.19,108.97 v91.19,109.98
  Bottom 0.381: v88.14,37.34 82.55,31.75 82.55,22.61 81.28,21.34 B07.P2 | v91.19,109.98 86.87,114.3 79.25,114.3 79.25,110.74 78.74,110.24 78.74,107.7 79.5,106.93 79.5,96.01 80.52,95 80.52,91.19 A07.P2
I/!O_INT_RQ  (via drill 0.61)
  Top 0.381: v44.45,36.83 44.45,54.1 43.94,54.61 43.94,57.91 44.2,58.17 44.2,73.41 43.94,73.66 43.94,76.71 44.45,77.22 44.45,79.25 43.69,80.01 43.69,83.06 44.2,83.57 44.2,85.85 43.69,86.36 43.69,89.41 44.2,89.92 44.2,92.2 43.43,92.96 43.43,96.27 A04.M2
  Bottom 0.381: v44.45,36.83 44.45,33.02 43.43,32 43.43,27.94 43.18,27.69 B04.M2
I/!O_SKP_RQ  (via drill 0.61)
  Top 0.381: v45.47,46.23 45.72,46.48 45.72,46.99 47.75,49.02 47.75,73.41 49.53,75.18 v49.53,76.2
  Bottom 0.381: v45.47,46.23 45.47,45.72 44.45,44.7 44.45,39.37 42.42,37.34 42.42,34.04 B04.K2 | v49.53,76.2 50.55,77.22 50.55,79.76 44.2,86.11 44.2,101.85 43.43,102.62 A04.K2
I/O_B-BRK
  Bottom 0.381: B06.P2 67.82,21.34 66.8,22.35 66.8,46.99 67.06,47.24 67.06,51.31 66.8,51.56 66.8,54.36 67.31,54.86 67.31,57.66 66.8,58.17 66.8,73.41 69.85,76.45 69.85,85.09 68.58,86.36 68.58,89.92 A06.P2
I/O_B-RUN  (via drill 0.61)
  Top 0.381: v43.43,36.07 44.2,35.31 44.2,16 43.18,14.99 B04.S2
  Bottom 0.381: v43.43,36.07 43.43,37.34 46.99,40.89 46.99,41.66 47.75,42.42 47.75,53.09 48.26,53.59 48.26,57.4 47.5,58.17 47.5,77.22 43.43,81.28 43.43,83.57 A04.S2
I/O_BAC_00  (via drill 0.61)
  Top 0.381: v21.34,89.66 22.1,88.9 22.1,74.17 21.59,73.66 21.59,56.64 21.08,56.13 B02.B1 | v22.1,97.28 22.86,98.04 22.86,101.85 22.1,102.62 22.1,123.7 21.08,124.71 A02.B1
  Bottom 0.381: v21.34,89.66 21.59,89.92 21.59,92.46 22.1,92.96 v22.1,97.28 | A01.B1 8.64,125.73 12.95,125.73 12.95,125.98 13.72,126.75 20.07,126.75 20.07,125.98 A02.B1
I/O_BAC_01
  Top 0.381: 19.05,114.55 20.07,114.55 20.07,118.62 A02.D1 | 19.05,114.55 16.76,114.55 12.95,118.36 12.95,118.62 8.64,118.62 A01.D1 | 19.05,114.55 19.05,74.17 19.56,73.66 19.56,57.91 19.3,57.66 19.3,54.86 19.81,54.36 19.81,50.04 20.07,49.78 B02.D1
I/O_BAC_02  (via drill 0.61)
  Top 0.381: v24.13,95.25 25.4,96.52 25.4,114.3 24.38,115.32 A02.E1
  Bottom 0.381: v24.13,95.25 24.13,93.98 22.35,92.2 22.35,86.87 21.59,86.11 21.59,83.31 22.1,82.8 22.1,80.26 21.59,79.76 21.59,76.96 22.1,76.45 22.1,74.17 21.59,73.66 21.59,57.66 22.1,57.15 22.1,48.01 23.37,46.74 B02.E1 | A01.E1 11.43,116.59 12.95,118.11 12.95,119.63 13.72,120.4 23.37,120.4 23.37,116.59 A02.E1
I/O_BAC_03  (via drill 0.61)
  Top 0.381: v17.02,107.95 16.26,108.71 16.26,108.97 11.68,108.97 A01.H1 | v17.02,25.4 15.75,26.67 15.75,38.35 12.45,41.66 12.45,48.01 10.16,50.29 10.16,51.31 9.65,51.82 9.65,62.23 v10.16,62.74 | v10.67,74.93 4.57,81.03 v4.32,81.03 | v5.33,88.9 6.35,89.92 6.35,95.5 9.14,98.3 v9.14,98.55
  Bottom 0.381: v17.02,107.95 23.11,107.95 23.11,109.22 A02.H1 | v17.02,25.4 17.02,23.88 18.8,22.1 18.8,20.83 20.57,20.83 22.35,22.61 22.35,34.04 23.11,34.8 23.11,38.86 23.37,39.12 B02.H1 | v10.16,62.74 10.67,63.25 v10.67,74.93 | v4.32,81.03 3.56,81.79 3.56,83.57 3.3,83.82 3.3,85.6 5.33,87.63 v5.33,88.9 | v9.14,98.55 9.65,99.06 9.65,107.95 10.67,108.97 A01.H1
I/O_BAC_04  (via drill 0.61)
  Top 0.381: v20.07,21.84 21.59,20.32 21.59,18.8 22.35,18.03 22.35,7.37 26.42,3.3 v35.31,3.3 | v53.85,31.5 53.85,57.4 53.34,57.91 53.34,73.66 53.85,74.17 53.85,76.45 53.34,76.96 53.34,80.01 54.1,80.77 v54.1,99.82 | v15.49,107.95 13.72,107.95 12.7,106.93 12.7,106.68 8.64,106.68 A01.J1
  Bottom 0.381: v20.07,21.84 19.05,22.86 19.05,34.54 20.32,35.81 B02.J1 | v35.31,3.3 53.85,21.84 v53.85,31.5 | v54.1,99.82 53.85,100.08 53.85,108.97 42.42,120.4 25.15,120.4 25.15,115.06 21.08,111 16,111 16,107.95 | 16,107.95 16,107.44 16.51,106.93 20.07,106.93 A02.J1 | 16,107.95 v15.49,107.95
I/O_BAC_05  (via drill 0.61)
  Top 0.381: v18.03,99.31 18.03,98.55 13.46,98.55 12.7,99.31 12.7,99.57 8.64,99.57 A01.L1 | v24.13,88.9 25.15,89.92 25.15,91.19 24.38,91.95 v20.07,91.95 | v14.99,90.93 13.21,90.93 v13.21,92.2
  Bottom 0.381: v18.03,99.31 20.07,99.31 20.07,99.57 A02.L1 | v24.13,88.9 24.13,87.63 22.35,85.85 22.35,83.57 22.86,83.06 22.86,80.01 22.35,79.5 22.35,77.22 22.86,76.71 22.86,73.91 22.35,73.41 22.35,57.91 22.86,57.4 22.86,56.64 25.4,54.1 25.4,45.72 22.35,42.67 22.35,36.32 21.59,35.56 21.59,31.24 21.08,30.73 B02.L1 | v20.07,91.95 17.02,91.95 16,90.93 v14.99,90.93 | v13.21,92.2 8.13,97.28 8.13,99.31 A01.L1
I/O_BAC_06  (via drill 0.61)
  Top 0.381: v15.75,97.28 11.68,97.28 A01.M1 10.67,96.27 9.65,95.25 9.65,88.9 v9.4,88.65 | v9.4,63.75 7.11,66.04 v7.11,71.12 | v5.33,74.68 v7.37,76.71
  Bottom 0.381: v15.75,97.28 16.76,98.3 23.37,98.3 23.37,97.54 A02.M1 | v9.4,63.75 9.14,63.5 9.14,62.23 9.4,61.98 9.4,20.07 13.21,16.26 13.21,16 21.34,16 25.15,19.81 25.15,25.65 24.38,26.42 B02.M1 | v7.11,71.12 5.33,72.9 v5.33,74.68 | v7.37,76.71 8.89,78.23 8.89,79.76 9.4,80.26 v9.4,88.65
I/O_BAC_07  (via drill 0.61)
  Top 0.381: 15.75,88.65 v18.03,88.65 | 15.75,88.65 15.49,88.65 14.99,89.15 14.99,89.92 11.68,89.92 A01.P1 | v20.07,90.68 23.11,90.68 A02.P1 | v13.46,46.48 13.21,46.74 13.21,48.26 12.95,48.51 12.95,51.31 13.46,51.82 v13.46,54.1 | v13.72,84.07 15.75,86.11 15.75,88.65
  Bottom 0.381: v18.03,88.65 v20.07,90.68 | v13.46,46.48 12.7,45.72 12.7,19.3 20.07,19.3 21.08,20.32 23.11,20.32 B02.P1 | v13.46,54.1 13.21,54.36 13.21,54.61 12.95,54.86 12.95,57.66 13.21,57.91 13.21,70.1 12.7,70.61 12.7,76.45 13.21,76.96 13.21,80.01 12.95,80.26 12.95,81.53 13.72,82.3 v13.72,84.07
I/O_BAC_08  (via drill 0.61)
  Top 0.381: v7.11,58.17 6.6,57.66 6.6,27.43 16,18.03 16,13.72 16.76,12.95 21.34,12.95 v21.34,13.97 | A02.S1 24.38,83.57 24.64,83.31 24.64,78.99 25.15,78.49 25.15,76.96 22.86,74.68 22.86,59.94 22.35,59.44 22.35,19.05 23.37,18.03 23.37,14.99 B02.S1
  Bottom 0.381: v7.11,58.17 7.11,65.53 9.65,68.07 9.65,78.23 10.16,78.74 10.16,83.06 10.67,83.57 A01.S1 | v21.34,13.97 23.11,13.97 B02.S1
I/O_BAC_09  (via drill 0.61)
  Top 0.381: v16,89.66 16,95 v14.99,96.01
  Bottom 0.381: v16,89.66 14.48,89.66 12.7,87.88 12.7,82.3 12.19,81.79 12.19,80.01 12.45,79.76 12.45,77.22 11.94,76.71 11.94,70.36 12.45,69.85 12.45,58.17 12.19,57.91 12.19,54.61 12.45,54.36 12.45,51.05 13.72,49.78 B02.D2 | v14.99,96.01 12.7,98.3 12.7,112.27 | 12.7,112.27 12.7,116.84 13.97,118.11 13.97,118.36 A02.D2 | 12.7,112.27 6.6,118.36 6.6,118.62 2.29,118.62 A01.D2
I/O_BAC_10  (via drill 0.61)
  Top 0.381: A01.E2 5.08,116.59 6.6,118.11 6.6,119.63 7.37,120.4 17.02,120.4 17.02,116.59 A02.E2 | v13.72,85.6 10.67,88.65 v10.67,88.9
  Bottom 0.381: v13.72,85.6 15.75,83.57 15.75,77.22 17.02,75.95 17.02,72.39 16,71.37 16,47.75 17.02,46.74 B02.E2 | v10.67,88.9 9.4,90.17 9.4,95 7.11,97.28 7.11,98.81 6.1,99.82 6.1,114.55 5.33,115.32 A01.E2
I/O_BAC_11  (via drill 0.61)
  Top 0.381: A01.H2 5.33,109.98 9.65,109.98 10.67,111 17.02,111 17.02,110.24 A02.H2 | v11.94,50.04 12.19,50.29 12.19,51.56 12.45,51.82 12.45,62.23 8.64,66.04 v8.64,71.12 | v4.57,82.3 3.56,83.31 3.56,83.57 3.3,83.82 v3.3,100.84
  Bottom 0.381: v11.94,50.04 11.94,49.53 15.75,45.72 15.75,41.66 17.02,40.39 B02.H2 | v8.64,71.12 6.35,73.41 6.35,80.52 v4.57,82.3 | v3.3,100.84 3.3,107.95 4.32,108.97 A01.H2
I/O_BMB_00  (via drill 0.61)
  Top 0.381: v34.04,91.95 34.04,89.92 34.8,89.15 34.8,86.61 34.29,86.11 34.29,83.31 34.8,82.8 34.8,80.26 34.29,79.76 34.29,76.96 34.8,76.45 34.8,74.17 34.29,73.66 34.29,56.64 33.78,56.13 B03.B1 | v31.5,119.38 33.27,121.16 33.27,124.71 A03.B1
  Bottom 0.381: v34.04,91.95 34.8,92.71 34.8,95.5 32.26,98.04 32.26,99.06 31.5,99.82 31.5,105.16 31.24,105.41 31.24,108.71 31.5,108.97 v31.5,119.38
I/O_BMB_01  (via drill 0.61)
  Top 0.381: v31.75,88.65 31.75,74.17 32.51,73.41 32.51,58.17 32,57.66 32,54.86 32.51,54.36 32.51,50.04 32.77,49.78 B03.D1 | v32.51,96.27 32.26,96.52 32.26,99.06 32,99.31 32,102.11 32.51,102.62 v32.51,104.9
  Bottom 0.381: v31.75,88.65 31.75,95.5 v32.51,96.27 | v32.51,104.9 32.26,105.16 32.26,105.41 32,105.66 32,108.46 34.8,111.25 34.8,114.3 33.78,115.32 33.78,118.36 A03.D1
I/O_BMB_02  (via drill 0.61)
  Top 0.381: v33.27,34.54 35.05,36.32 35.05,40.13 36.58,41.66 36.58,45.47 B03.E1 | v36.07,93.47 35.81,93.73 35.81,95.5 35.05,96.27 35.05,98.81 35.56,99.31 35.56,101.85 35.05,102.36 35.05,114.3 36.07,115.32 A03.E1
  Bottom 0.381: v33.27,34.54 31.75,36.07 31.75,45.47 33.78,47.5 33.78,47.75 34.8,48.77 34.8,50.8 32.51,53.09 32.51,54.36 32,54.86 32,57.66 34.29,59.94 34.29,73.66 34.8,74.17 34.8,76.45 34.29,76.96 34.29,79.76 34.8,80.26 34.8,82.8 34.29,83.31 34.29,86.11 35.05,86.87 35.05,91.95 36.07,92.96 v36.07,93.47
I/O_BMB_03
  Top 0.381: B03.J1 33.78,37.08 34.29,37.59 34.29,41.66 34.8,42.16 34.8,43.94 34.29,44.45 34.29,48.26 34.8,48.77 34.8,50.8 34.29,51.31 34.29,54.61 35.05,55.37 35.05,73.41 35.56,73.91 35.56,76.71 35.05,77.22 35.05,79.5 35.56,80.01 35.56,83.06 35.05,83.57 35.05,85.85 35.56,86.36 35.56,89.41 35.05,89.92 35.05,95.25 34.29,96.01 34.29,99.06 34.8,99.57 34.8,101.6 33.78,102.62 33.78,105.66 A03.J1
I/O_BMB_04  (via drill 0.61)
  Top 0.381: v3.3,74.17 3.05,74.42 3.05,82.55 v2.54,83.06 | v4.32,101.6 3.3,102.62 3.3,117.35 12.7,126.75 34.8,126.75 v34.8,115.82
  Bottom 0.381: v3.3,74.17 3.3,71.63 6.1,68.83 6.1,58.17 5.84,57.91 5.84,54.61 6.1,54.36 6.1,22.35 12.45,16 12.45,12.95 30.99,12.95 37.85,19.81 37.85,25.65 37.08,26.42 B03.M1 | v2.54,83.06 2.54,86.11 3.05,86.61 3.05,88.9 2.54,89.41 2.54,92.46 3.3,93.22 3.3,99.31 4.32,100.33 v4.32,101.6 | v34.8,115.82 35.31,115.32 35.31,114.81 35.56,114.55 35.56,110.49 35.05,109.98 35.05,98.55 36.07,97.54 A03.M1
I/O_BMB_05  (via drill 0.61)
  Top 0.381: v35.81,35.56 35.05,34.8 35.05,16 36.07,14.99 B03.S1 | v35.56,44.7 35.05,45.21 35.05,48.01 35.56,48.51 35.56,51.05 35.05,51.56 35.05,54.36 38.1,57.4 38.1,71.12 37.34,71.88 37.34,76.71 37.85,77.22 37.85,79.76 37.08,80.52 37.08,83.57 A03.S1
  Bottom 0.381: v35.81,35.56 35.56,35.81 35.56,38.61 35.05,39.12 35.05,41.4 35.56,41.91 v35.56,44.7
I/O_BMB_06  (via drill 0.61)
  Top 0.381: v29.72,87.38 30.73,88.39 30.73,89.15 31.5,89.92 31.5,98.81 31.24,99.06 31.24,102.36 31.5,102.62 31.5,114.55 30.73,115.32 A03.E2
  Bottom 0.381: v29.72,87.38 28.7,86.36 28.7,51.56 29.21,51.05 29.21,47.24 29.72,46.74 B03.E2
I/O_BMB_07  (via drill 0.61)
  Top 0.381: v29.72,92.2 28.7,91.19 28.7,80.77 27.94,80.01 27.94,76.71 29.21,75.44 29.21,73.91 28.7,73.41 28.7,58.17 29.21,57.66 29.21,54.86 28.7,54.36 28.7,51.56 29.21,51.05 29.21,48.51 28.7,48.01 28.7,45.47 29.21,44.96 29.21,41.91 28.7,41.4 28.7,39.12 29.21,38.61 29.21,34.54 29.72,34.04 B03.K2
  Bottom 0.381: v29.72,92.2 30.99,93.47 30.99,95.76 31.5,96.27 31.5,98.81 30.73,99.57 30.73,102.62 A03.K2
I/O_BMB_08  (via drill 0.61)
  Top 0.381: v26.67,71.37 26.16,71.88 26.16,73.41 25.65,73.91 25.65,76.45 25.91,76.71 25.91,80.01 25.4,80.52 25.4,89.15 28.7,92.46 28.7,92.71 29.21,93.22 30.73,93.22 30.73,90.93 A03.P2
  Bottom 0.381: v26.67,71.37 26.67,57.91 25.65,56.9 25.65,54.86 26.16,54.36 26.16,53.09 28.45,50.8 28.45,22.61 29.72,21.34 B03.P2
I/O_BMB_09  (via drill 0.61)
  Top 0.381: v32.51,47.75 32.51,45.47 31.75,44.7 31.75,20.32 30.99,19.56 30.99,15.49 30.48,14.99 B03.S2 | v30.23,75.44 28.7,76.96 28.7,79.76 29.72,80.77 29.72,83.57 A03.S2
  Bottom 0.381: v32.51,47.75 31.75,48.51 31.75,54.1 31.24,54.61 31.24,57.91 31.5,58.17 31.5,71.37 30.23,72.64 v30.23,75.44
I/O_BMB_10
  Top 0.381: B03.T2 27.43,11.68 28.45,12.7 28.45,38.35 27.94,38.86 27.94,41.66 28.45,42.16 28.45,44.7 27.94,45.21 27.94,48.26 28.45,48.77 28.45,50.8 27.94,51.31 27.94,54.61 28.45,55.12 28.45,57.4 27.94,57.91 27.94,73.66 28.45,74.17 28.45,75.18 27.18,76.45 27.18,80.26 A03.T2
I/O_BMB_11  (via drill 0.61)
  Top 0.381: v24.64,56.9 24.64,54.86 25.4,54.1 25.4,6.35 26.42,5.33 B03.V2
  Bottom 0.381: v24.64,56.9 25.65,57.91 25.65,71.88 26.67,72.9 26.67,73.91 A03.V2
I/O_DATA_IN  (via drill 0.61)
  Top 0.381: v55.12,25.4 54.1,26.42 54.1,28.45 v54.86,29.21 | v62.23,82.55 63.5,83.82 63.5,106.93 v67.82,111.25
  Bottom 0.381: v55.12,25.4 56.9,23.62 56.9,9.65 65.53,9.65 69.6,13.72 69.6,25.65 68.83,26.42 B06.M2 | v54.86,29.21 54.86,32 54.1,32.77 54.1,48.01 56.64,50.55 56.64,51.56 57.4,52.32 57.4,57.66 57.66,57.91 57.66,73.66 57.4,73.91 57.4,76.71 62.23,81.53 v62.23,82.55 | v67.82,111.25 69.6,111.25 69.6,102.62 68.58,101.6 68.58,97.54 A06.M2
I/O_PWR_CLR
  Top 0.381: 2.92,73.03 2.03,73.91 A01.V2 | 2.92,73.03 3.05,72.9 3.05,25.4 9.4,19.05 9.4,5.33 13.72,5.33 B02.V2 | A02.V2 13.72,74.17 11.43,74.17 10.41,73.15 3.05,73.15 2.92,73.03
I/O_TS03
  Top 0.381: 16,79.5 16,82.55 17.02,83.57 A02.S2 | 16,79.5 16,76.96 17.27,75.69 17.27,74.93 18.8,73.41 18.8,58.17 18.54,57.91 18.54,54.61 19.05,54.1 19.05,16.26 17.78,14.99 B02.S2 | 16,79.5 12.7,79.5 8.89,83.31 8.89,83.57 5.33,83.57 A01.S2
I/O_TS04  (via drill 0.61)
  Top 0.381: v13.72,72.14 v4.32,72.14 4.06,71.88 v4.06,69.34
  Bottom 0.381: v4.32,72.14 4.32,74.68 3.3,75.69 3.3,78.99 2.03,80.26 A01.T2 | v13.72,72.14 15.75,74.17 15.75,76.2 14.73,77.22 14.73,80.26 A02.T2 | v4.06,69.34 3.3,68.58 3.3,24.13 9.4,18.03 9.4,11.68 13.72,11.68 B02.T2
IOP_1  (via drill 0.61)
  Top 0.381: A01.K2 5.33,103.63 9.65,103.63 9.65,103.89 10.41,104.65 17.02,104.65 17.02,103.89 A02.K2 | v6.35,82.55 6.35,80.26 10.16,76.45 14.48,76.45 15.75,75.18 15.75,74.17 14.99,73.41 14.99,72.39 15.75,71.63 15.75,39.37 16.51,38.61 16.51,34.54 17.02,34.04 B02.K2
  Bottom 0.381: v6.35,82.55 6.35,98.55 5.33,99.57 5.33,102.62 A01.K2
IOP_2  (via drill 0.61)
  Top 0.381: v4.32,88.14 6.6,85.85 9.65,85.85 | 9.65,85.85 10.41,85.85 v10.41,87.12 | v7.62,53.85 7.62,52.83 9.4,51.05 9.4,32 15.75,25.65 15.75,24.38 17.53,24.38 18.03,24.89 18.03,26.42 B02.M2 | v9.65,66.55 v13.97,70.87 | v16,72.9 16.51,73.41 16.51,75.44 13.21,78.74 11.94,78.74 11.94,78.99 11.43,79.5 v11.18,79.5 | v11.43,82.55 10.67,82.55 9.65,83.57 9.65,85.85
  Bottom 0.381: v4.32,88.14 4.32,88.65 3.3,89.66 3.3,90.93 4.06,91.69 4.06,96.01 4.32,96.27 A01.M2 | v10.41,87.12 13.97,90.68 13.97,91.44 14.73,92.2 16.26,92.2 16.26,95.5 17.02,96.27 A02.M2 | v7.62,53.85 6.6,54.86 6.6,56.13 8.38,57.91 8.38,65.28 v9.65,66.55 | v13.97,70.87 v16,72.9 | v11.18,79.5 11.43,79.76 v11.43,82.55
IOP_4  (via drill 0.61)
  Top 0.381: v18.03,101.6 7.62,101.6 6.6,100.58 6.6,96.77 5.59,95.76 5.59,91.69 5.08,91.19 A01.P2 | v21.08,101.6 22.1,100.58 22.1,98.81 20.32,97.03 v20.32,95.5 | v18.03,92.96 17.78,92.71 17.78,91.19 A02.P2
  Bottom 0.381: B02.P2 17.02,21.34 16,22.35 16,36.32 19.05,39.37 19.05,86.11 17.02,88.14 17.02,89.92 A02.P2 | v21.08,101.6 v18.03,101.6 | v20.32,95.5 18.03,93.22 v18.03,92.96
TTINST
  Top 0.381: B04.T2 40.13,11.68 41.15,12.7 41.15,76.2 40.13,77.22 40.13,80.26 A04.T2